# EAGLE schematic SurgicalPCB (EAGLE 6.3)
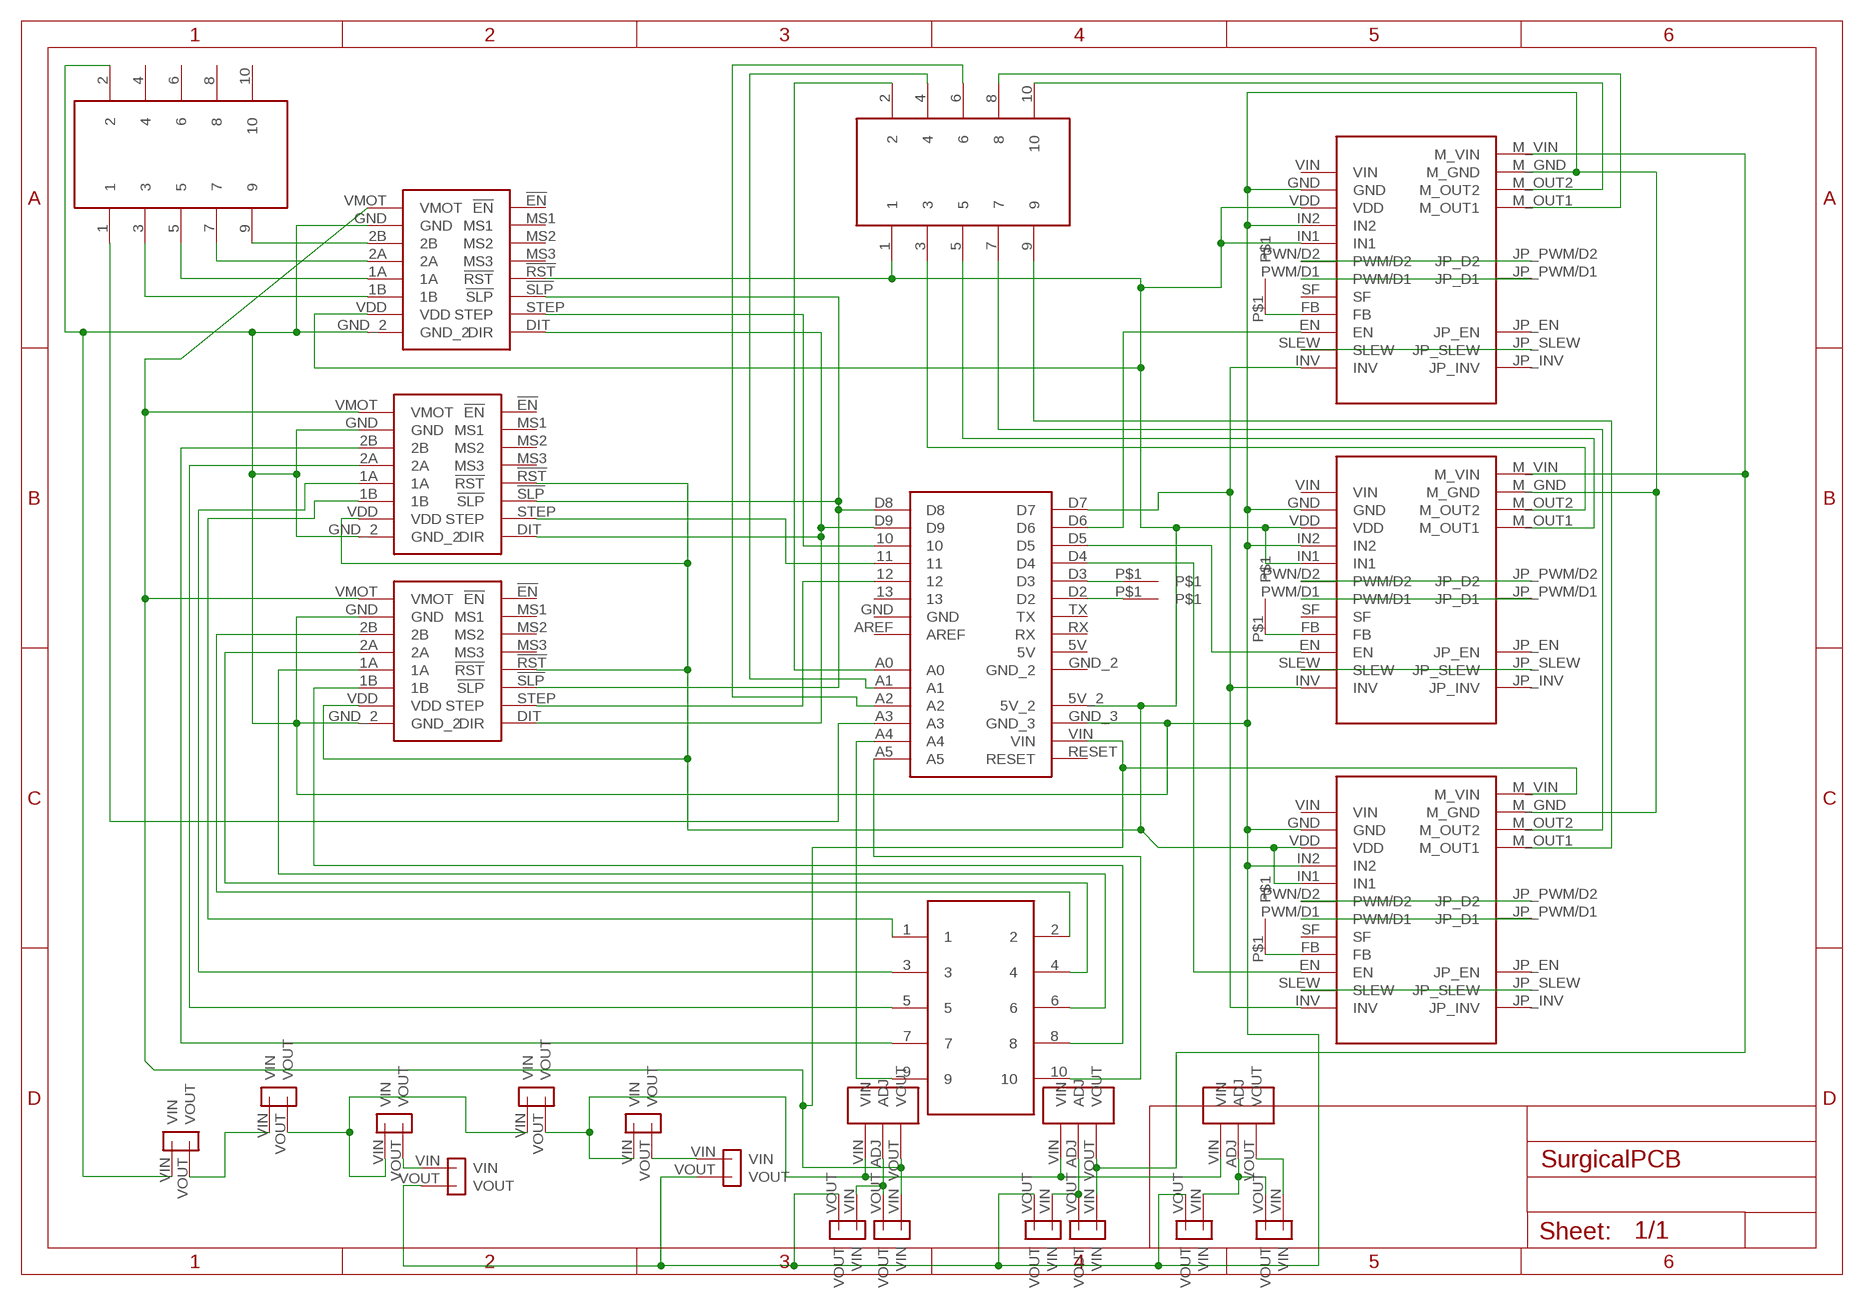
[diagram p0: schematic, sheet 1]

## Parts
6V  V_REG  [V_REG]
10V  V_REG  [V_REG]
E_STOP  RESISTOR  [RESISTOR]
EV  V_REG  [V_REG]
LED_GREEN  RESISTOR  [RESISTOR]
LED_R  RESISTOR  [RESISTOR]
LED_RES  RESISTOR  [RESISTOR]
LED_RES_G  RESISTOR  [RESISTOR]
POWER_SWITCH  RESISTOR  [RESISTOR]
POWERPLUG  RESISTOR  [RESISTOR]
RES6-1  RESISTOR  [RESISTOR]
RES_6-2  RESISTOR  [RESISTOR]
RES_10-1  RESISTOR  [RESISTOR]
RES_10-2  RESISTOR  [RESISTOR]
RES_EV-1  RESISTOR  [RESISTOR]
RES_EV-2  RESISTOR  [RESISTOR]
U$1  A4955  [A4955]
U$2  A4955  [A4955]
U$3  A4955  [A4955]
U$4  BOARDUINOSTD  [BOARDUINO]
U$5  MC33926  [MC33926]
U$6  MC33926  [MC33926]
U$7  MC33926  [MC33926]
U$8  2_5_RIBBON  [2_5_RIBBON]
U$9  2_5_RIBBON  [2_5_RIBBON]
U$10  2_5_RIBBON  [2_5_RIBBON]
U$14  PROPE_HOLE  [PROPE_HOLE]
U$23  PROPE_HOLE  [PROPE_HOLE]
U$24  PROPE_HOLE  [PROPE_HOLE]
U$25  PROPE_HOLE  [PROPE_HOLE]
U$26  PROPE_HOLE  [PROPE_HOLE]

## Nets
6V_RAIL [Power]: 6V.VOUT RES6-1.VIN U$5.M_VIN U$6.M_VIN
10V_RAIL [Power]: 10V.VOUT RES_10-1.VIN U$1.VMOT U$2.VMOT U$3.VMOT U$4.VIN U$7.M_VIN
24V_1 [Power]: POWER_SWITCH.VIN POWERPLUG.VOUT
24V_2 [Power]: E_STOP.VIN LED_RES.VIN POWER_SWITCH.VOUT
24V_3: LED_R.VIN LED_RES.VOUT
24V_4 [Power]: 6V.VIN 10V.VIN E_STOP.VOUT EV.VIN LED_RES_G.VIN
24V_5: LED_GREEN.VIN LED_RES_G.VOUT
GND [Power]: LED_GREEN.VOUT LED_R.VOUT POWERPLUG.VIN RES_6-2.VOUT RES_10-2.VOUT RES_EV-2.VOUT U$1.GND U$1.GND_2 U$2.GND U$2.GND_2 U$3.GND U$3.GND_2 U$4.GND_3 U$5.GND U$5.IN2 U$5.M_GND U$6.GND U$6.IN2 U$6.M_GND U$7.GND U$7.IN2 U$7.M_GND U$9.2
LOGIC_HIGH_RAIL: U$1.!RST U$1.VDD U$2.!RST U$2.VDD U$3.!RST U$3.VDD U$4.5V_2 U$5.IN1 U$5.VDD U$6.IN1 U$6.VDD U$7.IN1 U$7.VDD U$8.1
N$1: U$3.STEP U$4.12
N$2: U$1.!SLP U$2.!SLP U$3.!SLP U$4.D8
N$3: U$1.DIT(DIR) U$2.DIT(DIR) U$3.DIT(DIR) U$4.D9
N$4: U$1.STEP U$4.10
N$5: U$2.STEP U$4.11
N$6: U$7.FB U$14.P$1
N$7: U$6.FB U$23.P$1
N$9: U$5.JP_PWM/D2(JP_D2) U$5.PWN/D2(PWM/D2)
N$10: U$5.JP_PWM/D1(JP_D1) U$5.PWM/D1
N$11: U$5.JP_SLEW U$5.SLEW
N$12: U$5.FB U$24.P$1
N$13: U$4.D3 U$25.P$1
N$14: U$6.JP_PWM/D2(JP_D2) U$6.PWN/D2(PWM/D2)
N$15: U$6.JP_PWM/D1(JP_D1) U$6.PWM/D1
N$16: U$6.JP_SLEW U$6.SLEW
N$17: U$4.D2 U$26.P$1
N$19: U$7.JP_PWM/D2(JP_D2) U$7.PWN/D2(PWM/D2)
N$20: U$7.JP_PWM/D1(JP_D1) U$7.PWM/D1
N$21: U$7.JP_SLEW U$7.SLEW
N$22: U$4.D7 U$5.INV U$6.INV U$7.INV
N$23 [Motor]: U$5.M_OUT2 U$8.10
N$24: U$4.D6 U$5.EN
N$25: U$4.D5 U$6.EN
N$26: U$4.D4 U$7.EN
N$27 [Motor]: U$5.M_OUT1 U$8.8
N$28 [Motor]: U$6.M_OUT2 U$8.3
N$29 [Motor]: U$6.M_OUT1 U$8.5
N$30 [Motor]: U$7.M_OUT2 U$8.7
N$31 [Motor]: U$7.M_OUT1 U$8.9
N$32: U$4.A2 U$8.6
N$33: U$4.A1 U$8.4
N$34: U$4.A0 U$8.2
N$35 [Motor]: U$3.2B U$10.2
N$36 [Motor]: U$3.2A U$10.4
N$37 [Motor]: U$3.1A U$10.6
N$38 [Motor]: U$3.1B U$10.8
N$39: U$4.A5 U$10.10
N$40 [Motor]: U$2.1B U$10.1
N$41 [Motor]: U$2.1A U$10.3
N$42 [Motor]: U$2.2A U$10.5
N$43 [Motor]: U$2.2B U$10.7
N$44: U$4.A4 U$10.9
N$45 [Motor]: U$1.2B U$9.9
N$46 [Motor]: U$1.2A U$9.7
N$47 [Motor]: U$1.1A U$9.5
N$48 [Motor]: U$1.1B U$9.3
N$49: U$4.A3 U$9.1
N$52: 10V.ADJ RES_10-1.VOUT RES_10-2.VIN
N$60: 6V.ADJ RES6-1.VOUT RES_6-2.VIN
N$64: EV.VOUT RES_EV-1.VIN
N$65: EV.ADJ RES_EV-1.VOUT RES_EV-2.VIN
Unconnected: U$1.!EN U$1.MS1 U$1.MS2 U$1.MS3 U$2.!EN U$2.MS1 U$2.MS2 U$2.MS3 U$3.!EN U$3.MS1 U$3.MS2 U$3.MS3 U$4.5V U$4.13 U$4.AREF U$4.GND U$4.GND_2 U$4.RESET U$4.RX U$4.TX U$5.JP_EN U$5.JP_INV U$5.SF U$5.VIN U$6.JP_EN U$6.JP_INV U$6.SF U$6.VIN U$7.JP_EN U$7.JP_INV U$7.SF U$7.VIN U$9.4 U$9.6 U$9.8 U$9.10

## Library data of the parts
6V 10V EV = SURGICALv2:V_REG
E_STOP LED_GREEN LED_R LED_RES LED_RES_G POWER_SWITCH POWERPLUG RES6-1 RES_6-2 RES_10-1 RES_10-2 RES_EV-1 RES_EV-2 = SURGICALv2:RESISTOR
U$1-U$3 = A4955:A4955
U$4 = SURGICAL:BOARDUINO
U$5-U$7 = SURGICALv2:MC33926
U$8-U$10 = SURGICALv2:2_5_RIBBON
U$14 U$23-U$26 = SURGICALv2:PROPE_HOLE

## Net classes
0 default: width 0.381 mm, drill 0.762 mm, clearance 0.381 mm
1 Power: width 1.016 mm, drill 1.27 mm, clearance 0.381 mm
2 Motor: width 0.762 mm, drill 1.27 mm, clearance 0.381 mm